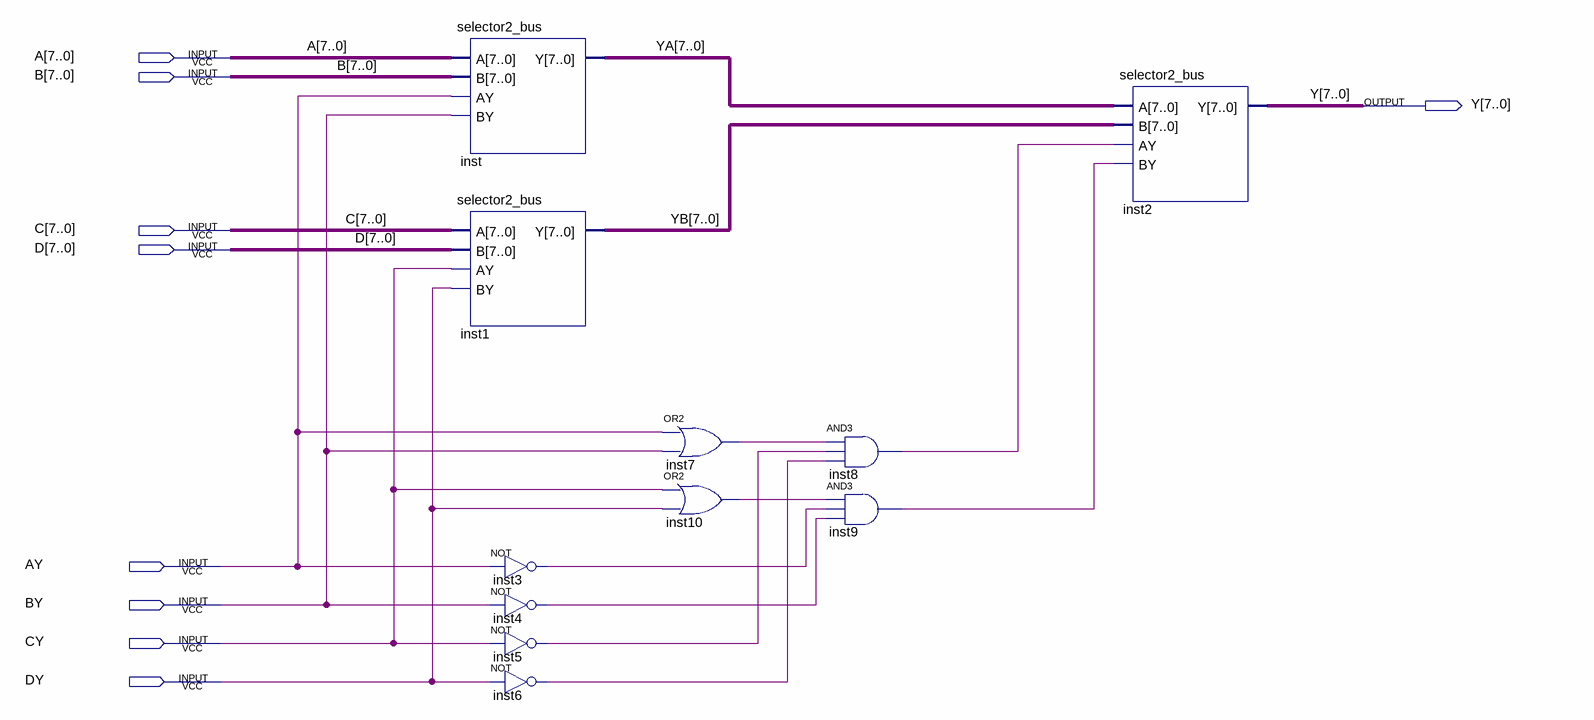
[diagram p0: schematic sheet]
// Quartus schematic selector4_bus.bdf as structural Verilog: 11 symbols, 9 pins
module selector4_bus (
  input  [7:0] A,
  input  [7:0] B,
  input  [7:0] C,
  input  [7:0] D,
  input  AY,
  input  BY,
  input  CY,
  input  DY,
  output [7:0] Y
);

  wire inst3_out, inst4_out, inst5_out, inst6_out, inst7_out, inst8_out, inst9_out, inst10_out;
  wire [7:0] YA, YB;

  selector2_bus inst (.A(A), .B(B), .AY(AY), .BY(BY), .Y(YA));
  selector2_bus inst1 (.A(C), .B(D), .AY(CY), .BY(DY), .Y(YB));
  not inst3 (inst3_out, AY);
  not inst4 (inst4_out, BY);
  not inst5 (inst5_out, CY);
  not inst6 (inst6_out, DY);
  or inst7 (inst7_out, AY, BY);
  or inst10 (inst10_out, CY, DY);
  and inst8 (inst8_out, inst7_out, inst5_out, inst6_out);
  and inst9 (inst9_out, inst10_out, inst3_out, inst4_out);
  selector2_bus inst2 (.A(YA), .B(YB), .AY(inst8_out), .BY(inst9_out), .Y(Y));
endmodule
